# Altium schematic sheet NUWC_Ballast_Sensor_Power_Interface_Board.SchDoc
size 558 x 431 mm; SheetNumber: 1; SheetTotal: 1; ENG_APP_DATE: --/--/--; DSN_APP_DATE: --/--/--; CHK_APP_DATE: --/--/--
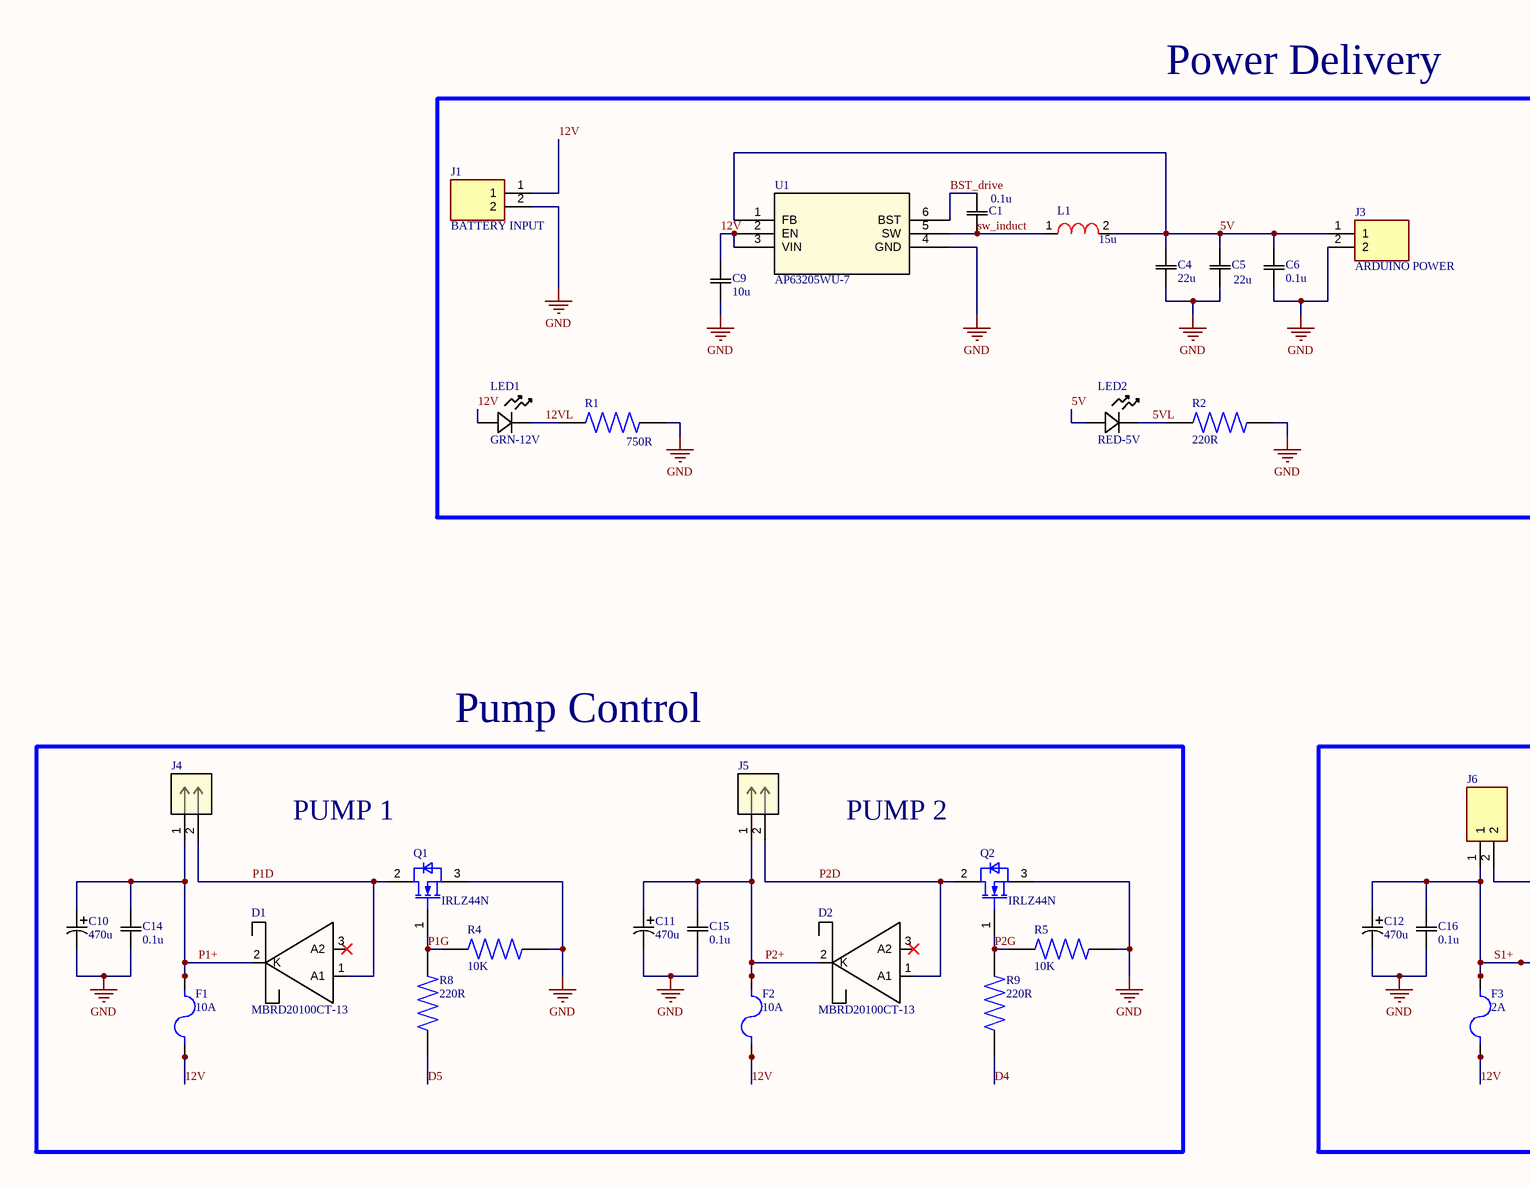
[diagram p0: NUWC_Ballast_Sensor_Power_Interface_Board.SchDoc, top left]
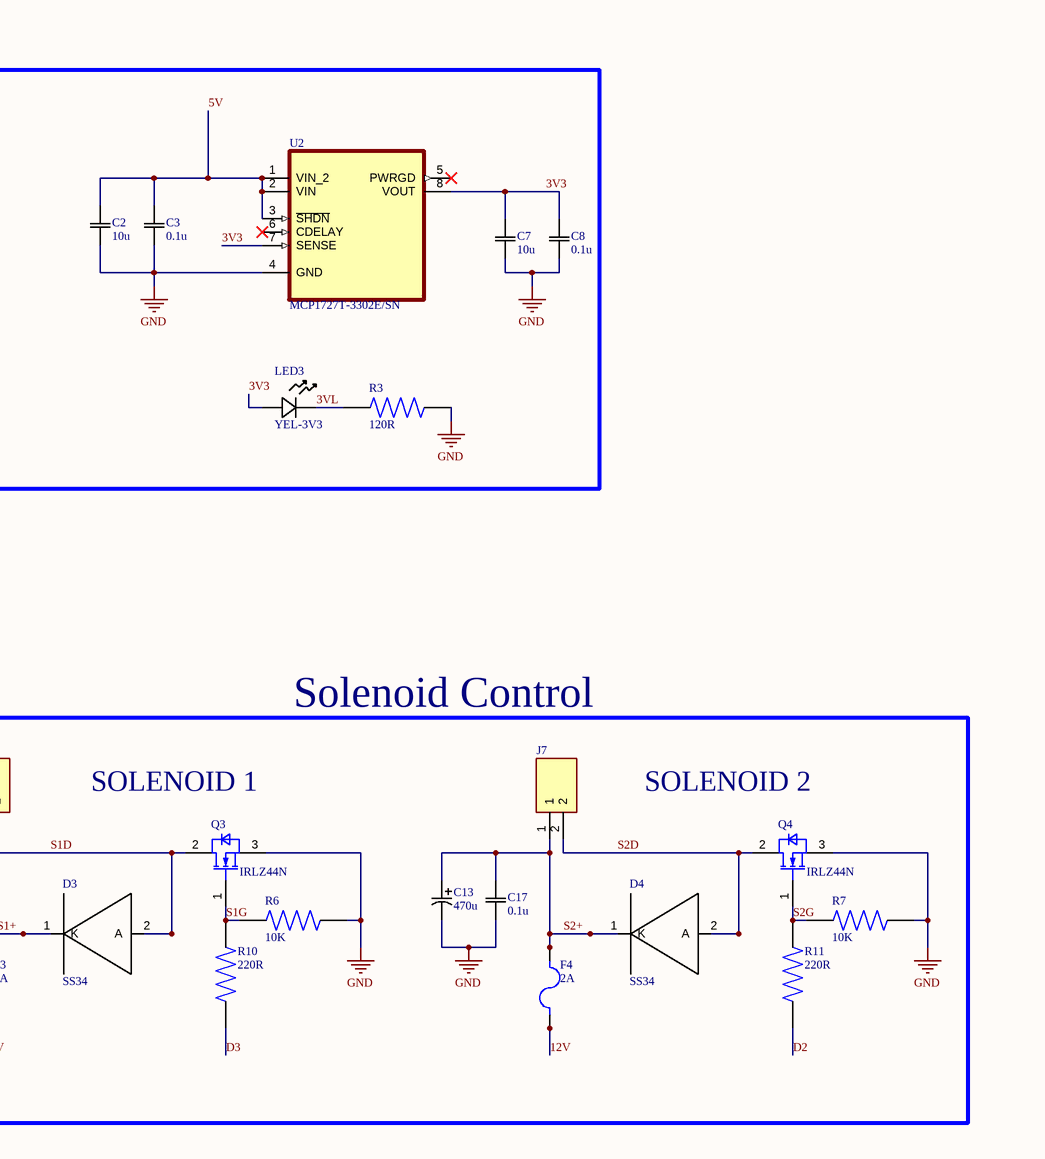
[diagram p1: NUWC_Ballast_Sensor_Power_Interface_Board.SchDoc, top right]
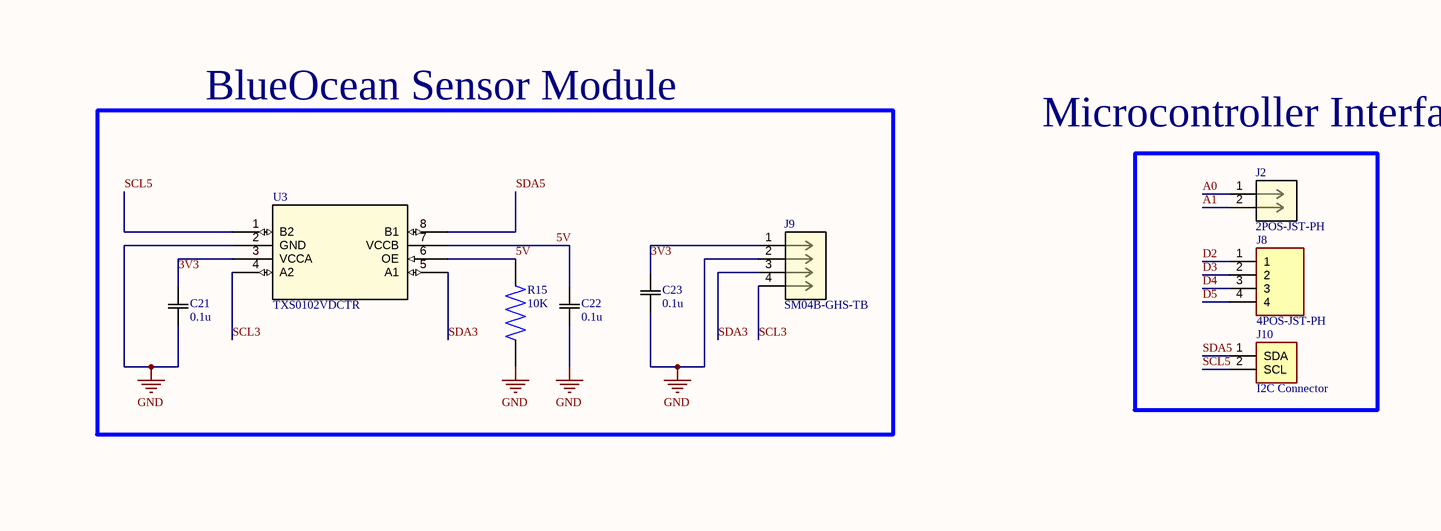
[diagram p2: NUWC_Ballast_Sensor_Power_Interface_Board.SchDoc, bottom left]
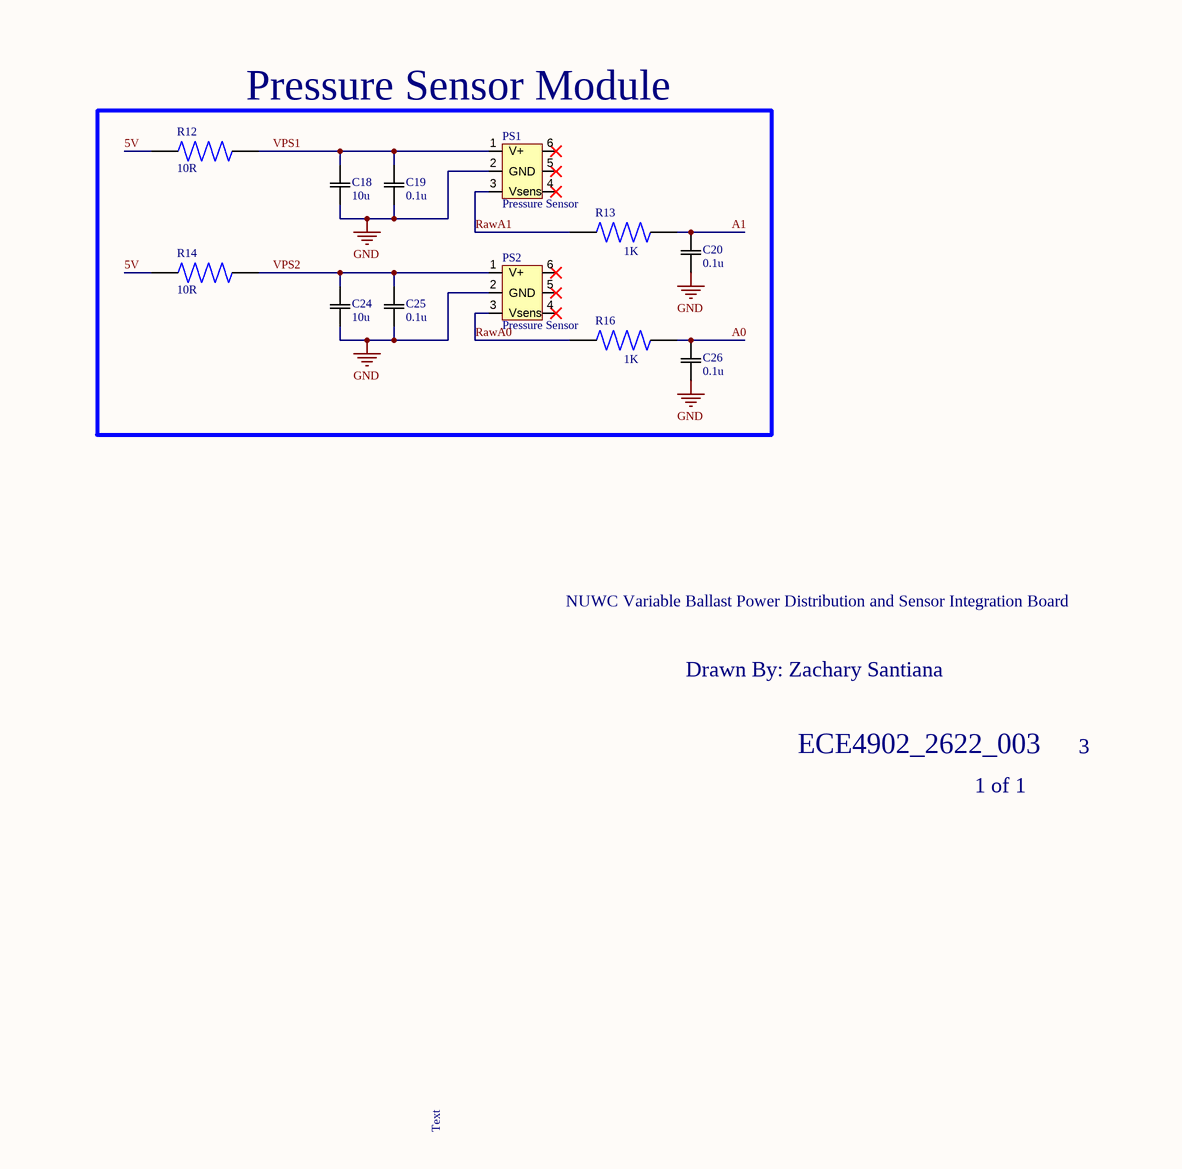
[diagram p3: NUWC_Ballast_Sensor_Power_Interface_Board.SchDoc, bottom right]

## Parts
C1  value 0.1u  [CAP_0805_KEMET]  (hidden comment: C0805C104K3RACTU)
C2  value 10u  [CAP_0805_KEMET]  (hidden comment: C0805C106K3PACTU)
C3  value 0.1u  [CAP_0805_KEMET]  (hidden comment: C0805C104K3RACTU)
C4  value 22u  [CAP_0805_SAMSUNG]  (hidden comment: CL21A226MAYNNNE)
C5  value 22u  [CAP_0805_SAMSUNG]  (hidden comment: CL21A226MAYNNNE)
C6  value 0.1u  [CAP_0805_KEMET]  (hidden comment: C0805C104K3RACTU)
C7  value 10u  [CAP_0805_KEMET]  (hidden comment: C0805C106K3PACTU)
C8  value 0.1u  [CAP_0805_KEMET]  (hidden comment: C0805C104K3RACTU)
C9  value 10u  [CAP_0805_KEMET]  (hidden comment: C0805C106K3PACTU)
C10  value 470u  [PCAP_10x10-ELECT_NCA]  (hidden comment: UWT1E471MNL1GS)
C11  value 470u  [PCAP_10x10-ELECT_NCA]  (hidden comment: UWT1E471MNL1GS)
C12  value 470u  [PCAP_10x10-ELECT_NCA]  (hidden comment: UWT1E471MNL1GS)
C13  value 470u  [PCAP_10x10-ELECT_NCA]  (hidden comment: UWT1E471MNL1GS)
C14  value 0.1u  [CAP_0805_KEMET]  (hidden comment: C0805C104K3RACTU)
C15  value 0.1u  [CAP_0805_KEMET]  (hidden comment: C0805C104K3RACTU)
C16  value 0.1u  [CAP_0805_KEMET]  (hidden comment: C0805C104K3RACTU)
C17  value 0.1u  [CAP_0805_KEMET]  (hidden comment: C0805C104K3RACTU)
C18  value 10u  [CAP_0805_KEMET]  (hidden comment: C0805C106K3PACTU)
C19  value 0.1u  [CAP_0805_KEMET]  (hidden comment: C0805C104K3RACTU)
C20  value 0.1u  [CAP_0805_KEMET]  (hidden comment: C0805C104K3RACTU)
C21  value 0.1u  [CAP_0805_KEMET]  (hidden comment: C0805C104K3RACTU)
C22  value 0.1u  [CAP_0805_KEMET]  (hidden comment: C0805C104K3RACTU)
C23  value 0.1u  [CAP_0805_KEMET]  (hidden comment: C0805C104K3RACTU)
C24  value 10u  [CAP_0805_KEMET]  (hidden comment: C0805C106K3PACTU)
C25  value 0.1u  [CAP_0805_KEMET]  (hidden comment: C0805C104K3RACTU)
C26  value 0.1u  [CAP_0805_KEMET]  (hidden comment: C0805C104K3RACTU)
D1  MBRD20100CT-13  [MBRD20100CT_SHOT_DIODE]
D2  MBRD20100CT-13  [MBRD20100CT_SHOT_DIODE]
D3  SS34  [SHOTT_DIODE]
D4  SS34  [SHOTT_DIODE]
F1  10A  [FUSE_3557-2]
F2  10A  [FUSE_3557-2]
F3  2A  [FUSE_3557-2]
F4  2A  [FUSE_3557-2]
J1  BATTERY INPUT  [CUI_TBP02R1-381-02BE]
J2  2POS-JST-PH  [JST_S2B-PH-SM4-TB]
J3  ARDUINO POWER  [CUI_TBP02R1-381-02BE]
J4  26607020  [CONN_SD-42892-001_M450_02_MOL]  (value not drawn)
J5  26607020  [CONN_SD-42892-001_M450_02_MOL]  (value not drawn)
J6  BATTERY INPUT  [CUI_TBP02R1-381-02BE]  (value not drawn)
J7  BATTERY INPUT  [CUI_TBP02R1-381-02BE]  (value not drawn)
J8  4POS-JST-PH  [JST_S4B-PH-SM4-TB]
J9  SM04B-GHS-TB  [CONN_SM04B-GHS-TB_JST]
J10  I2C Connector  [MOLEX_530470210]
L1  15u  [inductor]
LED1  GRN-12V  [LED_LGR971-KN-1_OSR]
LED2  RED-5V  [LED_LGR971-KN-1_OSR]
LED3  YEL-3V3  [LED_LGR971-KN-1_OSR]
PS1  Pressure Sensor  [PCBComponent_1]
PS2  Pressure Sensor  [PCBComponent_1]
Q1  IRLZ44N  [IFX-PG-TO220-3-904-1]
Q2  IRLZ44N  [IFX-PG-TO220-3-904-1]
Q3  IRLZ44N  [IFX-PG-TO220-3-904-1]
Q4  IRLZ44N  [IFX-PG-TO220-3-904-1]
R1  value 750R  [RESC2012X50N]  (hidden comment: CRCW08051K00FKEA)
R2  value 220R  [RESC2012X50N]  (hidden comment: CRCW0805560RFKEA)
R3  value 120R  [RESC2012X50N]  (hidden comment: CRCW0805120RFKEA)
R4  value 10K  [RESC2012X50N]  (hidden comment: CRCW080510K0FKEA)
R5  value 10K  [RESC2012X50N]  (hidden comment: CRCW080510K0FKEA)
R6  value 10K  [RESC2012X50N]  (hidden comment: CRCW080510K0FKEA)
R7  value 10K  [RESC2012X50N]  (hidden comment: CRCW080510K0FKEA)
R8  value 220R  [RESC2012X50N]  (hidden comment: CRCW0805220RFKEA)
R9  value 220R  [RESC2012X50N]  (hidden comment: CRCW0805220RFKEA)
R10  value 220R  [RESC2012X50N]  (hidden comment: CRCW0805220RFKEA)
R11  value 220R  [RESC2012X50N]  (hidden comment: CRCW0805220RFKEA)
R12  value 10R  [RESC2012X50N]  (hidden comment: CRCW080510R0FKEA)
R13  value 1K  [RESC2012X50N]  (hidden comment: CRCW08051K00FKEA)
R14  value 10R  [RESC2012X50N]  (hidden comment: CRCW080510R0FKEA)
R15  value 10K  [RESC2012X50N]  (hidden comment: CRCW080510K0FKEA)
R16  value 1K  [RESC2012X50N]  (hidden comment: CRCW08051K00FKEA)
U1  AP63205WU-7  [SOIC_05WU-7_DIO]
U2  MCP1727T-3302E/SN  [SOIC127P490X175-8N]
U3  TXS0102VDCTR  [SSOP8_DCT_TEX]

## Blocks framed on the sheet
Power Delivery: C1-C9 J1 J3 L1 LED1-LED3 R1-R3 U1 U2
Pump Control: C10 C11 C14 C15 D1 D2 F1 F2 J4 J5 Q1 Q2 R4 R5 R8 R9
Solenoid Control: C12 C13 C16 C17 D3 D4 F3 F4 J6 J7 Q3 Q4 R6 R7 R10 R11
BlueOcean Sensor Module: C21-C23 J9 R15 U3
Pressure Sensor Module: C18-C20 C24-C26 PS1 PS2 R12-R14 R16

## Nets
GND: C2.1 C3.1 C4.2 C5.2 C6.1 C7.1 C8.1 C9.1 C10.2 C11.2 C12.2 C13.2 C14.1 C15.1 C16.1 C17.1 C18.1 C19.1 C20.1 C21.1 C22.2 C23.1 C24.1 C25.1 C26.1 J1.2 J3.2 J9.2 PS1.2(GND) PS2.2(GND) Q1.3(SOURCE) Q2.3(SOURCE) Q3.3(SOURCE) Q4.3(SOURCE) R1.2 R2.1 R3.2 R4.2 R5.2 R6.2 R7.2 R15.1 U1.4(GND) U2.4(GND) U3.2(GND)
3V3: C7.2 C8.2 C21.2 C23.2 J9.1 LED3.2 U2.7(SENSE) U2.8(VOUT) U3.3(VCCA)
3VL: LED3.1 R3.1
5V: C2.2 C3.2 C4.1 C5.1 C6.2 C22.1 J3.1 L1.2 LED2.2 R12.1 R14.1 R15.2 U1.1(FB) U2.1(VIN_2) U2.2(VIN) U2.3(~{SHDN}) U3.6(OE) U3.7(VCCB)
5VL: LED2.1 R2.2
12V: C9.2 F1.1_1 F1.1_2 F2.1_1 F2.1_2 F3.1_1 F3.1_2 F4.1_1 F4.1_2 J1.1 LED1.2 U1.2(EN) U1.3(VIN)
12VL: LED1.1 R1.1
A0: C26.2 J2.1 R16.2
A1: C20.2 J2.2 R13.2
BST_drive: C1.1 U1.6(BST)
D2: J8.1 R11.1
D3: J8.2 R10.1
D4: J8.3 R9.1
D5: J8.4 R8.1
P1+: C10.1 C14.2 D1.2(K) F1.2_1 F1.2_2 J4.1
P1D: D1.1(A1) J4.2 Q1.2(DRAIN)
P1G: Q1.1(GATE) R4.1 R8.2
P2+: C11.1 C15.2 D2.2(K) F2.2_1 F2.2_2 J5.1
P2D: D2.1(A1) J5.2 Q2.2(DRAIN)
P2G: Q2.1(GATE) R5.1 R9.2
RawA0: PS2.3(Vsens) R16.1
RawA1: PS1.3(Vsens) R13.1
S1+: C12.1 C16.2 D3.1(K) F3.2_1 F3.2_2 J6.1
S1D: D3.2(A) J6.2 Q3.2(DRAIN)
S1G: Q3.1(GATE) R6.1 R10.2
S2+: C13.1 C17.2 D4.1(K) F4.2_1 F4.2_2 J7.1
S2D: D4.2(A) J7.2 Q4.2(DRAIN)
S2G: Q4.1(GATE) R7.1 R11.2
SCL3: J9.4 U3.4(A2)
SCL5: J10.2(SCL) U3.1(B2)
SDA3: J9.3 U3.5(A1)
SDA5: J10.1(SDA) U3.8(B1)
sw_induct: C1.2 L1.1 U1.5(SW)
VPS1: C18.2 C19.2 PS1.1(V+) R12.2
VPS2: C24.2 C25.2 PS2.1(V+) R14.2

Not connected (* = marked no-connect by the designer): D1 3(A2)*; D2 3(A2)*; PS1 4* 5* 6*; PS2 4* 5* 6*; U2 5(PWRGD)* 6(CDELAY)*

## Notes on the sheet
- PUMP 1
- PUMP 2
- SOLENOID 1
- SOLENOID 2
- Microcontroller Interface
- NUWC Variable Ballast Power Distribution and Sensor Integration Board
- Drawn By: Zachary Santiana
- ECE4902_2622_003
- 1 of 1
- 3
- Text
- DWG. NO.
- REV.
- SHT.
- REVISION
- DESCRIPTION
- DATE
- APPROVED
- THIS DOCUMENT AND THE DATA DISCLOSED HEREIN OR HEREWITH IS THE PROPERTY OF ALTIUM LIMITED AND MAY BE FREELY DISTRIBUTED IN WHOLE. NO RIGHTS ARE RESERVED OR EXPRESS OR IMPLIED WARANTEE GIVEN.
- ENG:
- DSN:
- APPROVALS
- PROJECT
- DOCUMENT REVISION:
- DESIGN ITEM:
- CHK:
- BOM:
- REFERENCE DOCUMENTS
- PROJECT REVISION:
- TITLE
- FAB DWG:
- PCB DWG:
- ASSY DWG:
- SCALE:
- SIZE
- C
- CAGE CODE
- FILE NAME
- DWG NO.
- SHEET
- OF
- REV

## Library data of the parts
C1 C3 C6 C8 C14-C17 C19-C23 C25 C26 = C0805C104K3RACTU: Capacitor;Ceramic;Cap;.0.1uF;Tol 10%;SMT;Vol-Rtg 25V;X7R;Tape and Reel | KEMET C0805C104K3RACTU; SnapEDA_Link: https://www.snapeda.com/parts/C0805C104K3RACTU/KEMET/view-part/?ref=snap; Package: 805-2 KEMET; MF: KEMET; MP: C0805C104K3RACTU; Check_prices: https://www.snapeda.com/parts/C0805C104K3RACTU/KEMET/view-part/?ref=eda
C2 C7 C9 C18 C24 = C0805C106K3PACTU: Capacitor;Ceramic;Cap;.10uF;Tol 10%;SMT;Vol-Rtg 25V;X5R;Tape and Reel | KEMET C0805C106K3PACTU; SnapEDA_Link: https://www.snapeda.com/parts/C0805C104K3RACTU/KEMET/view-part/?ref=snap; Package: 805-2 KEMET; MF: KEMET; MP: C0805C106K3PACTU; Check_prices: https://www.snapeda.com/parts/C0805C104K3RACTU/KEMET/view-part/?ref=eda
C4 C5 = CL21A226MAYNNNE: Multilayer Ceramic Capacitors MLCC - SMD/SMT 22uF+/-20% 25V X5R 2012; MF: Samsung Electro-Mechanics; SnapEDA_Link: https://www.snapeda.com/parts/CL21A226MAYNNNE/Samsung/view-part/?ref=snap; Package: SMD-2 Samsung; MP: CL21A226MAYNNNE; Check_prices: https://www.snapeda.com/parts/CL21A226MAYNNNE/Samsung/view-part/?ref=eda
C10-C13 = UWT1E471MNL1GS_1: 470u; Manufacturer_Name: Nichicon; Copyright: Copyright (C) 2025 Ultra Librarian. All rights reserved.; Manufacturer_Part_Number: UWT1E471MNL1GS
D1 D2 = MBRD20100CT-13: DIODE ARR SCHOT 100V 10A TO2523 / Diodes Incorporated
D3 D4 = SS34: Description; Manufacturer_Name: onsemi; Copyright: Copyright (C) 2025 Ultra Librarian. All rights reserved.; Manufacturer_Part_Number: SS34; RefDes: RefDes; Type: Type
F1-F4 = 3557-2: THM 2 in 1 Auto Blade Holder; MF: Keystone Electronics; Package: Nonstandard Keystone; Check_prices: https://www.snapeda.com/parts/3557-2/Keystone+Electronics/view-part/?ref=eda; Value: *; Purchase-URL: https://pricing.snapeda.com/search/part/3557-2/?ref=eda; Availability: In Stock; SnapEDA_Link: https://www.snapeda.com/parts/3557-2/Keystone+Electronics/view-part/?ref=snap; MP: 3557-2; Price: None
J1 J3 J6 J7 = TBP02R1-381-02BE: 2~24 Poles, Pluggable,Receptacle, Horizontal, 3.81 Pitch, Terminal Block Connector; MF: Same Sky; SnapEDA_Link: https://www.snapeda.com/parts/TBP02R1-381-02BE/Same+Sky/view-part/?ref=snap; Package: None; Value: *; MP: TBP02R1-381-02BE; Check_prices: https://www.snapeda.com/parts/TBP02R1-381-02BE/Same+Sky/view-part/?ref=eda
J2 = JST_PH_2POS_SMD_RA
J4 J5 = 26607020: KK 396 Solid Right-Angle Header, Friction Lock, with Snap-in Plastic Peg  PCB Lock, 2 Circuits, Tin (Sn) Plating; Manufacturer_Name: Molex Connector Corporation; Copyright: Copyright (C) 2026 Ultra Librarian. All rights reserved.; Manufacturer_Part_Number: 26607020; Datasheet: https://www.molex.com/en-us/products/part-detail-pdf/26607020?display=pdf; RefDes: RefDes; Type: Type
J8 = S4B-PH-SM4-TB: Connector Header Surface Mount, Right Angle 4 position 0.079 (2.00mm); MF: JST Sales; SnapEDA_Link: https://www.snapeda.com/parts/S4B-PH-SM4-TB/JST/view-part/?ref=snap; Package: None; Value: *; MP: S4B-PH-SM4-TB; Check_prices: https://www.snapeda.com/parts/S4B-PH-SM4-TB/JST/view-part/?ref=eda
J9 = SM04B-GHS-TB: Description; Manufacturer_Name: JST; Copyright: Copyright (C) 2025 Ultra Librarian. All rights reserved.; Manufacturer_Part_Number: SM04B-GHS-TB; RefDes: RefDes; Type: Type
J10 = I2C Connector: Connector Header Through Hole 2 position 0.049 (1.25mm); MP: 530470210; MF: Molex; SnapEDA_Link: https://www.snapeda.com/parts/530470210/Molex/view-part/?ref=snap; Purchase-URL: https://pricing.snapeda.com/search/part/530470210/?ref=eda; Value: *; Digi-Key_Part_Number: WM1731-ND; Check_prices: https://www.snapeda.com/parts/530470210/Molex/view-part/?ref=eda; Package: None
L1 = Inductor
LED1 = LGR971-KN-1: GREEN DIFF LED; Manufacturer_Name: ams OSRAM; Copyright: Copyright (C) 2025 Ultra Librarian. All rights reserved.; Manufacturer_Part_Number: LGR971-KN-1
LED2 = LS R976-NR-1-0-20-R18: RED DIFF LED; Manufacturer_Name: ams OSRAM; Manufacturer_Part_Number: LGR971-KN-1; Copyright: Copyright (C) 2025 Ultra Librarian. All rights reserved.
LED3 = LY R976-PS-36-0-20-R18: YEL DIFF LED; Manufacturer_Name: ams OSRAM; Manufacturer_Part_Number: LGR971-KN-1; Copyright: Copyright (C) 2025 Ultra Librarian. All rights reserved.
Q1-Q4 = IRLZ44N: OptiMOS 3 Power-Transistor, VDS 100V; Manufacturer: Infineon Technologies; Manufacturer Order Number: IRLZ44N; PackageReference: PG-TO220-3-904
R1 R13 R16 = CRCW08051K00FKEA: Resistor,Thick Film,1 Kilohms,0.125 W,1%,SMT,0805,TCR 37 ppm/DegC,Cut Tape | Vishay Dale CRCW08051K00FKEA; SnapEDA_Link: https://www.snapeda.com/parts/CRCW08051K00FKEA/Vishay+Dale/view-part/?ref=snap; Package: 2012 Vishay; MF: Vishay; MP: CRCW08051K00FKEA; Check_prices: https://www.snapeda.com/parts/CRCW08051K00FKEA/Vishay+Dale/view-part/?ref=eda
R2 = CRCW0805560RFKEA: Resistor,Thick Film,560 Ohms,0.125 W,1%,SMT,0805,TCR 37 ppm/DegC,Cut Tape | Vishay Dale CRCW0805560RFKEA; MP: CRCW08051K00FKEA; SnapEDA_Link: https://www.snapeda.com/parts/CRCW08051K00FKEA/Vishay+Dale/view-part/?ref=snap; Package: 2012 Vishay; MF: Vishay; Check_prices: https://www.snapeda.com/parts/CRCW08051K00FKEA/Vishay+Dale/view-part/?ref=eda
R3 = CRCW0805120RFKEA: Resistor,Thick Film,120 Ohms,0.125 W,1%,SMT,0805,TCR 37 ppm/DegC,Cut Tape | Vishay Dale CRCW0805120RFKEA; MP: CRCW08051K00FKEA; SnapEDA_Link: https://www.snapeda.com/parts/CRCW08051K00FKEA/Vishay+Dale/view-part/?ref=snap; Package: 2012 Vishay; MF: Vishay; Check_prices: https://www.snapeda.com/parts/CRCW08051K00FKEA/Vishay+Dale/view-part/?ref=eda
R4-R7 R15 = CRCW080510K0FKEA: Resistor,Thick Film,10 Kilohms,0.125 W,1%,SMT,0805,TCR 37 ppm/DegC,Cut Tape | Vishay Dale CRCW080510K0FKEA; MP: CRCW08051K00FKEA; SnapEDA_Link: https://www.snapeda.com/parts/CRCW08051K00FKEA/Vishay+Dale/view-part/?ref=snap; Package: 2012 Vishay; MF: Vishay; Check_prices: https://www.snapeda.com/parts/CRCW08051K00FKEA/Vishay+Dale/view-part/?ref=eda
R8-R11 = CRCW0805220RFKEA: Resistor,Thick Film,220 Ohms,0.125 W,1%,SMT,0805,TCR 37 ppm/DegC,Cut Tape | Vishay Dale CRCW0805220RFKEA; MP: CRCW08051K00FKEA; SnapEDA_Link: https://www.snapeda.com/parts/CRCW08051K00FKEA/Vishay+Dale/view-part/?ref=snap; Package: 2012 Vishay; MF: Vishay; Check_prices: https://www.snapeda.com/parts/CRCW08051K00FKEA/Vishay+Dale/view-part/?ref=eda
R12 R14 = CRCW080510R0FKEA: Resistor,Thick Film, 10 Ohms,0.125 W,1%,SMT,0805,TCR 37 ppm/DegC,Cut Tape | Vishay Dale CRCW08051K00FKEA; SnapEDA_Link: https://www.snapeda.com/parts/CRCW08051K00FKEA/Vishay+Dale/view-part/?ref=snap; Package: 2012 Vishay; MF: Vishay; MP: CRCW08051K00FKEA; Check_prices: https://www.snapeda.com/parts/CRCW08051K00FKEA/Vishay+Dale/view-part/?ref=eda
U1 = AP63205WU-7: Description; Manufacturer_Name: Diodes Inc; Copyright: Copyright (C) 2025 Ultra Librarian. All rights reserved.; Manufacturer_Part_Number: AP63205WU-7; RefDes: RefDes; Type: Type
U2 = MCP1727T-3302E/SN: 1.5A CMOS LDO, Vout=3.3V, Extended Temp Range | Microchip Technology Inc. MCP1727T-3302E/SN; SnapEDA_Link: https://www.snapeda.com/parts/MCP1727T-3302E/SN/Microchip+Technology/view-part/?ref=snap; Package: SO-8 Microchip; Value: *; MF: Microchip Technology; MP: MCP1727T-3302E/SN; Check_prices: https://www.snapeda.com/parts/MCP1727T-3302E/SN/Microchip+Technology/view-part/?ref=eda
U3 = TXS0102VDCTR: Two-bit bidirectional level shifter for open-drain and push-pull applications 8-SSOP -40 to 85; Manufacturer_Name: Texas Instruments; Copyright: Copyright (C) 2025 Ultra Librarian. All rights reserved.; Manufacturer_Part_Number: TXS0102VDCTR; RefDes: RefDes; Type: Type